# EasyEDA Pro project MalO_SAO_EasyEDA.eprj, board PCB1
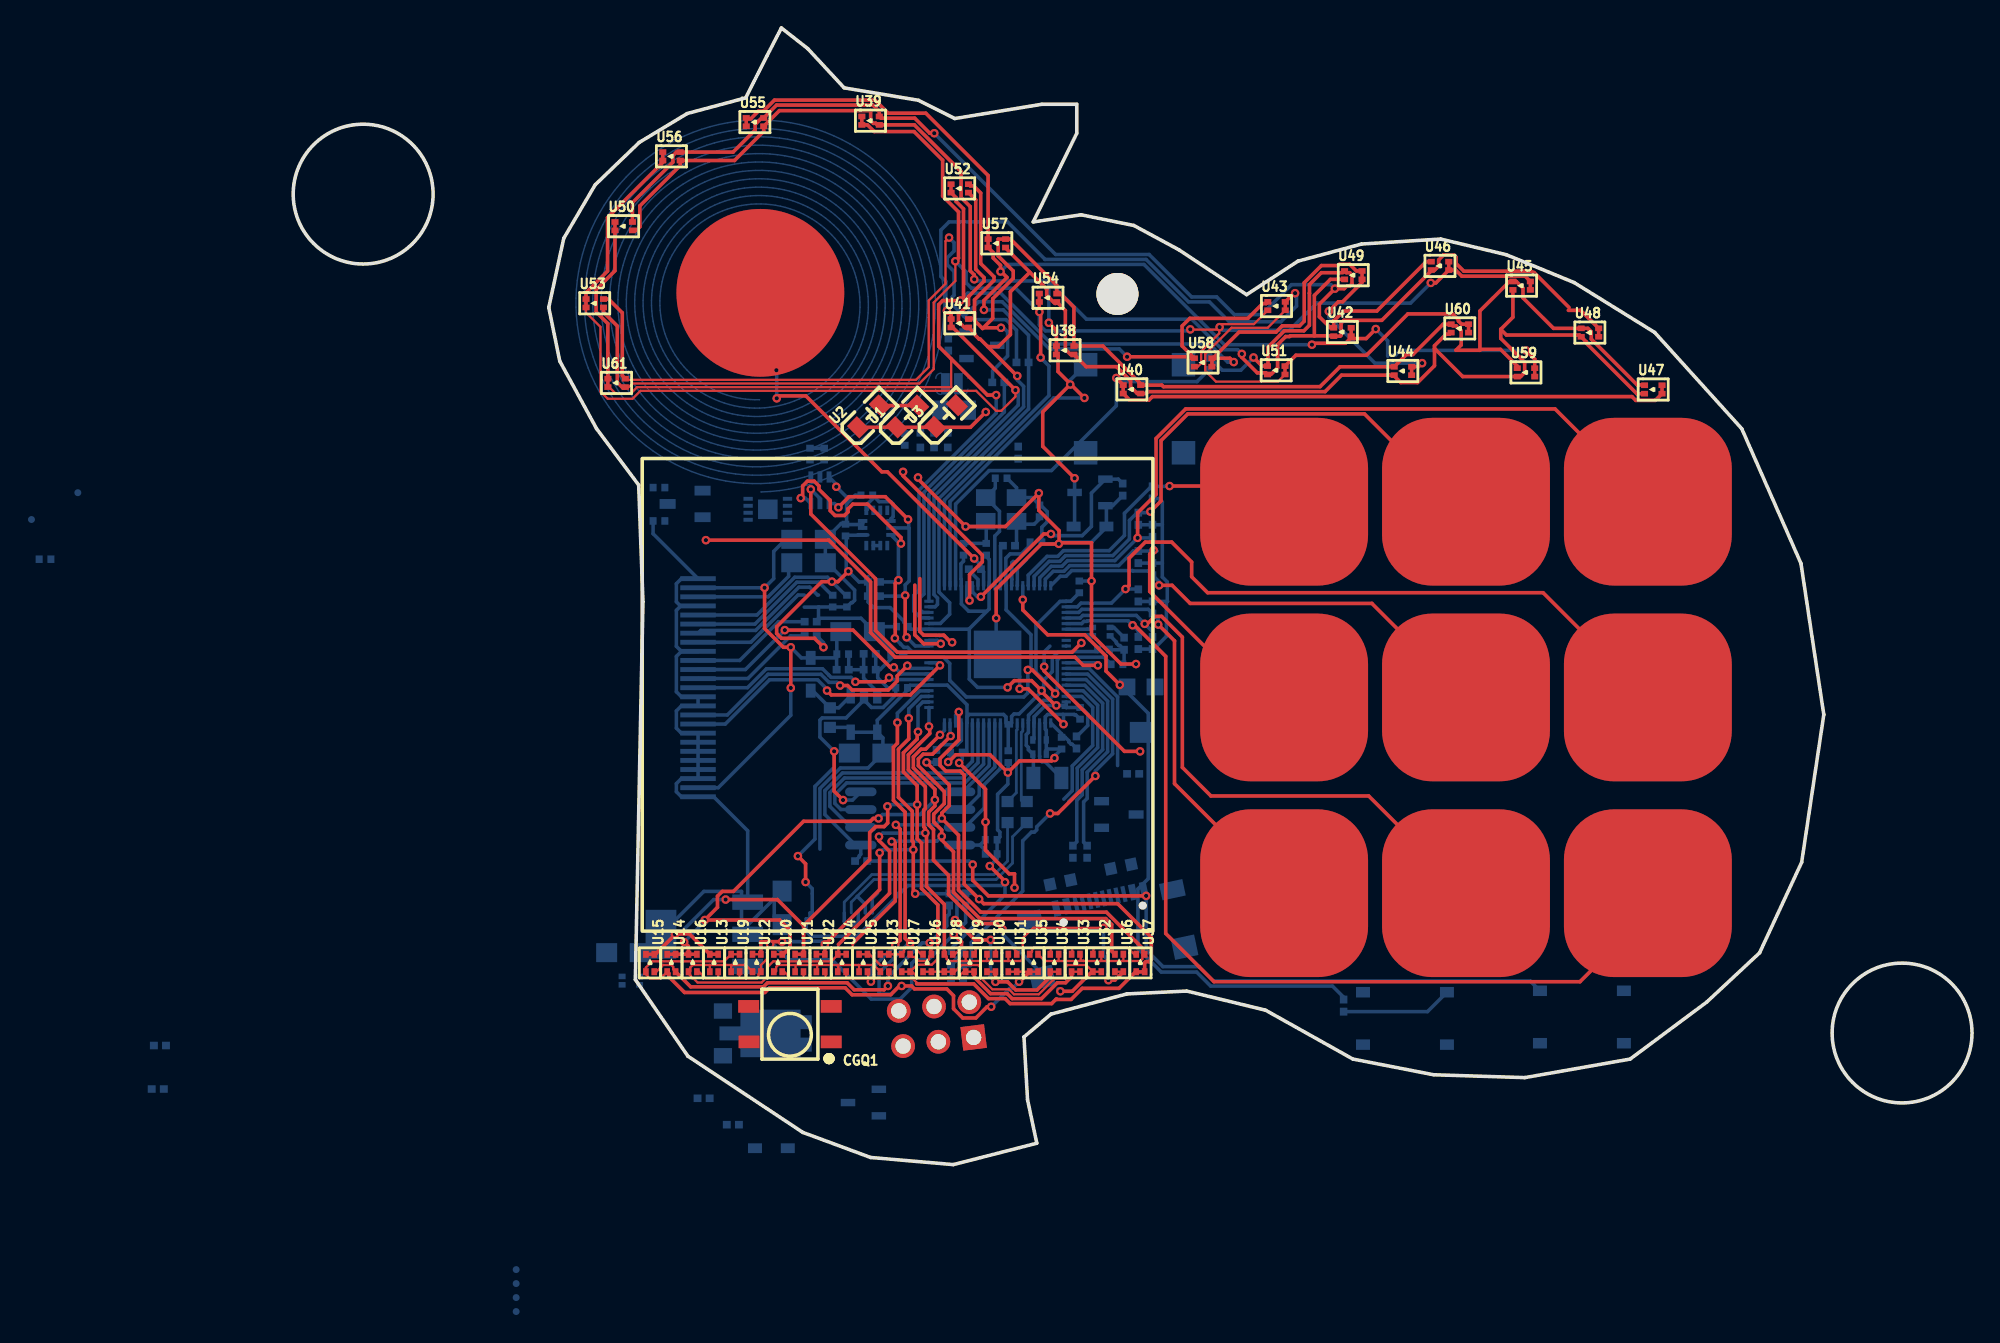
[diagram p4: board, top side]
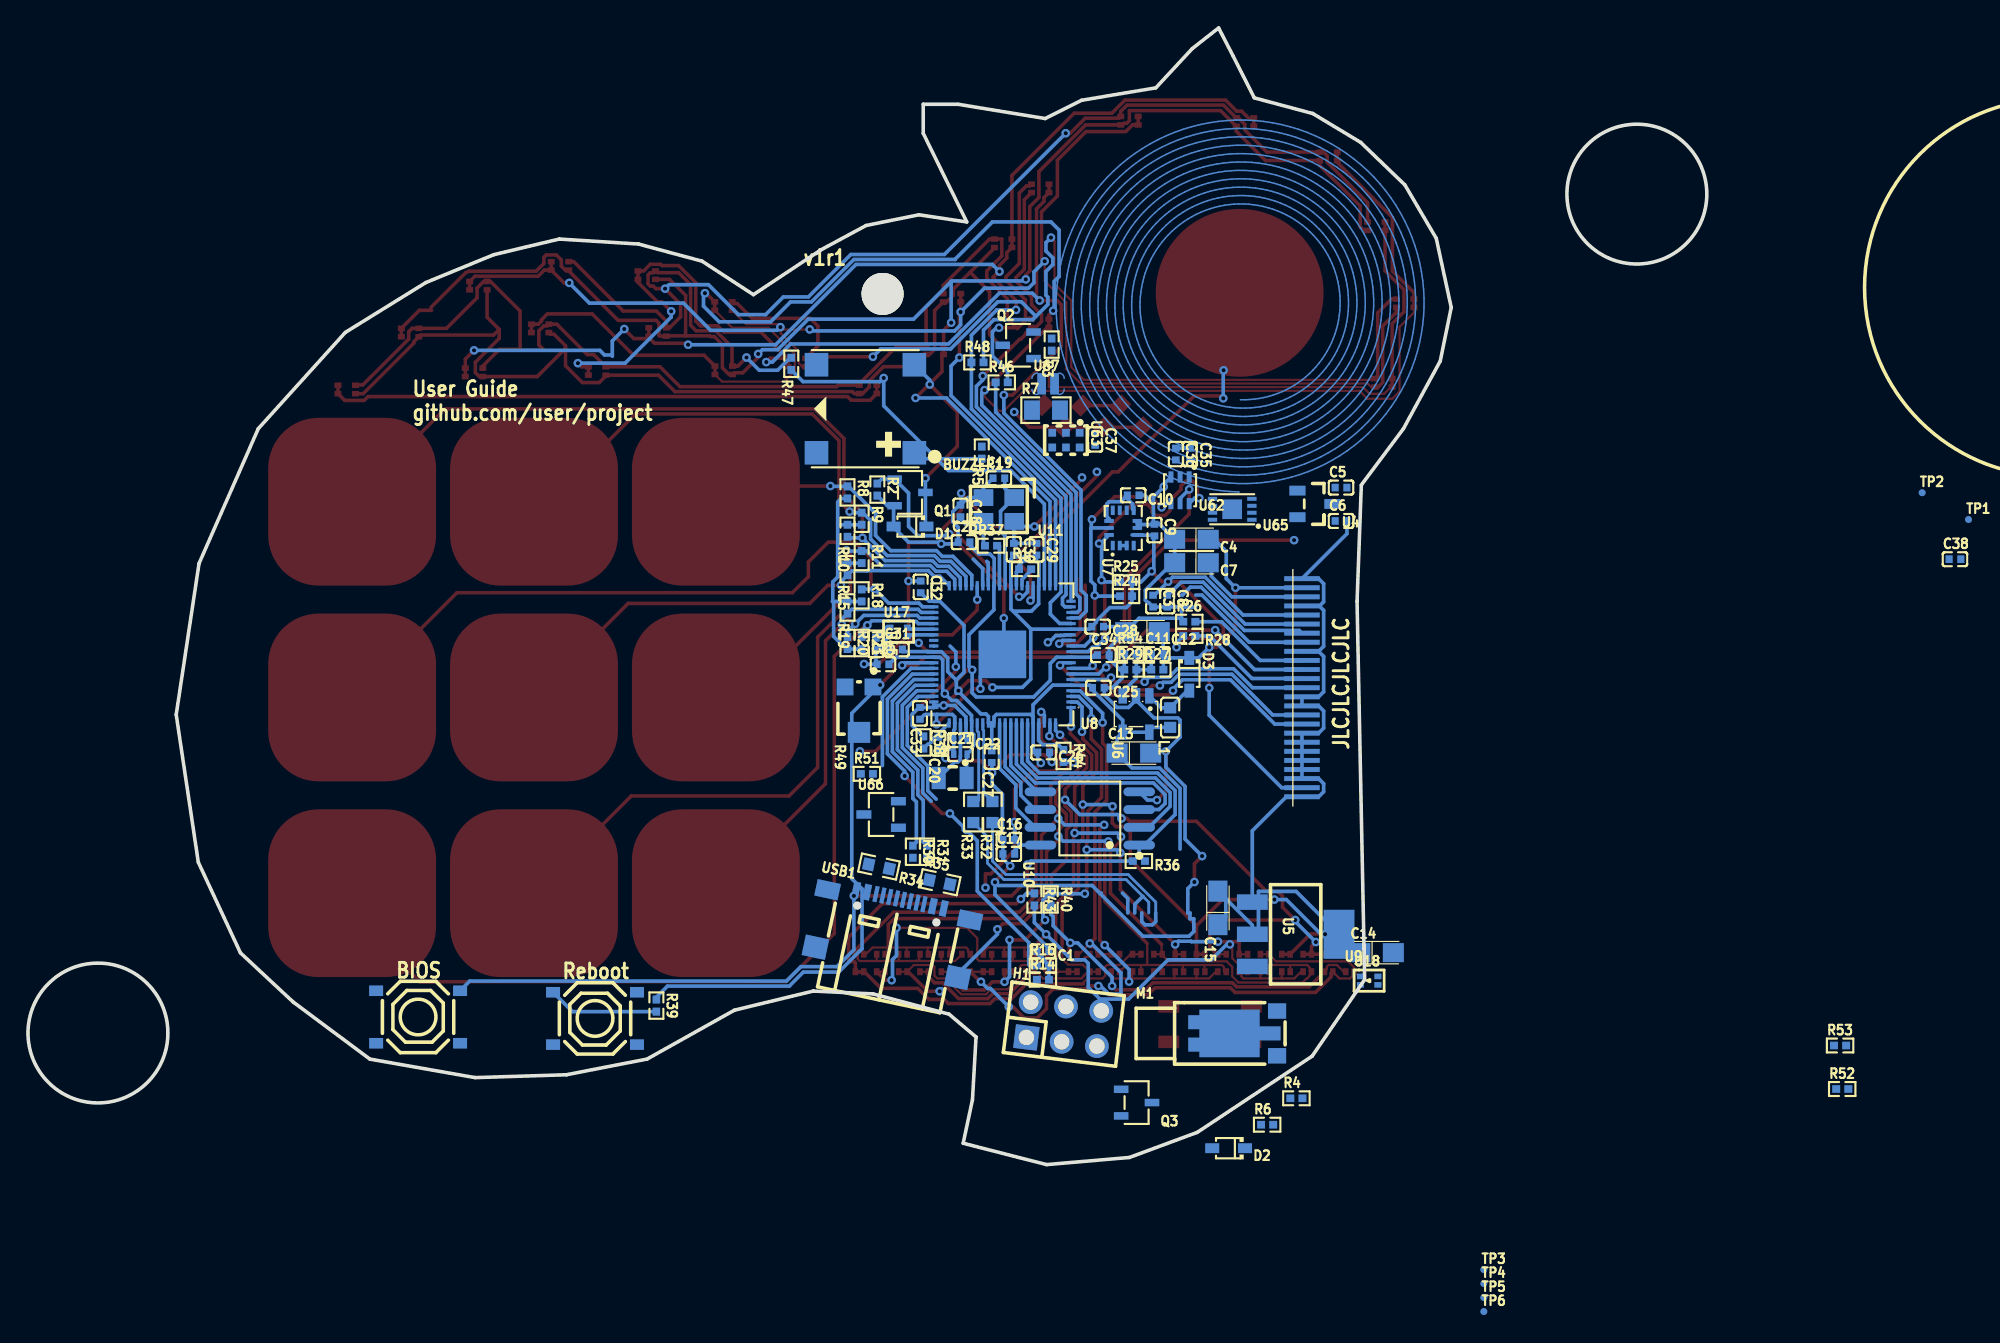
[diagram p5: board, bottom side, seen from below]

Outline 120 x 81.29 mm; copper layers: Top Layer, Bottom Layer. Coordinates in mm from the lower left corner of the outline.
Outline path: circle c5,69.41 r5 ; circle c115,9.41 r5 ; 18.27,61.3 19.34,66.25 21.58,70.07 24.74,73.11 28.16,75.17 32.34,76.3 33.86,79.29 34.89,81.29 36.78,79.81 39.38,77.01 44.69,76.12 47.29,74.82 53.51,75.84 56.01,75.84 56.01,73.76 52.9,67.42 56.31,67.93 60.09,67.17 63.3,65.43 68.15,62.22 71.82,64.62 76.36,65.84 82.02,66.2 86.71,65.08 91.56,63.09 97.32,59.52 103.54,52.63 107.77,42.99 109.41,32.18 107.82,21.62 104.81,15.15 101.04,11.63 95.56,7.55 88.04,6.22 81.51,6.43 75.75,7.55 69.5,11.04 63.86,12.41 59.59,12.21 54.17,10.76 52.23,9.13 52.49,4.64 53.15,1.53 47.19,0 41.27,0.51 36.43,2.3 28.21,7.75 24.46,13.23 25,40.26 24.69,48.6 21.69,52.63 19.05,57.47 18.27,61.3
Stack: Top Layer 0.035mm / Dielectric1 1.51mm FR4 er 4.5 / Bottom Layer 0.035mm

## Design rules (mm)
template: JLCPCB Capability(Two Layers Board)
spacing copperThickness1oz (default): track to track 0.102, other pairs 0.152 to 0.3
spacing copperThickness2oz: track to track 0.203, other pairs 0.152 to 0.3
track width copperThickness1oz (default): min 0.127, default 0.254, max 2.54
track width copperThickness2oz: min 0.203, default 0.254, max 2.54
differential pair differentialPair (default): width min 0.127, default 0.254, max 2.54; gap min 0.152, default 0.152
via viaSize (default): diameter min 0.5, default 0.61, max 10; hole min 0.3, default 0.305, max 6.3

## Placement (name value [footprint] x y rotation side)
BUZZER1  2.7kHz  [BUZ-SMD_4P-L7.5-W7.5-P7.59-TL]  60.14 54.06 0 bottom
C1  2.2uF  [C0402#2]  47.45 15.26 0 bottom
C3  100nF  [C0402#2]  39.58 40.3 270 bottom
C4  10uF  [CASE-A_3216]  36.84 44.72 0 bottom
C5  100nF  [C0402#2]  26.14 48.42 180 bottom
C6  100nF  [C0402#2]  26.14 46.03 180 bottom
C7  10uF  [CASE-A_3216]  36.84 43.05 0 bottom
C8  100nF  [C0402#2]  38.56 40.3 270 bottom
C9  100nF  [C0402#2]  39.48 45.38 270 bottom
C10  100nF  [C0402#2]  41 47.87 0 bottom
C11  100nF  [C0402#2]  39.28 36.51 180 bottom
C12  10uF  [CASE-A_3216]  40.34 38.12 0 bottom
C13  10uF  [CASE-A_3216]  40.95 29.43 180 bottom
C14  10uF  [CASE-A_3216]  23.61 15.16 180 bottom
C15  22uF  [CASE-A_3216]  34.94 18.36 90 bottom
C16  100nF  [C0402#2]  49.89 23.23 180 bottom
C17  4.7uF  [C0402#2]  49.89 22.22 180 bottom
C18  15pF  [C0402#2]  53.35 46.75 270 bottom
C19  15pF  [C0402#2]  50.6 49.09 180 bottom
C20  4.7uF  [C0402#2]  54.92 30.14 90 bottom
C21  4.7uF  [C0402]  53.35 29.36 180 bottom
C22  4.7uF  [C0402]  53.35 30.37 0 bottom
C23  100nF  [C0402#2]  53.09 44.52 180 bottom
C24  100nF  [C0402#2]  58.88 35.78 180 bottom
C25  100nF  [C0402#2]  43.49 34.11 0 bottom
C26  100nF  [C0402#2]  47.4 29.48 0 bottom
C27  100nF  [C0402#2]  51.11 29.18 90 bottom
C28  100nF  [C0402#2]  43.54 38.47 0 bottom
C29  100nF  [C0402#2]  47.91 44.01 270 bottom
C30  100nF  [C0402#2]  49.54 44.01 270 bottom
C31  100nF  [C0402#2]  57.92 36.85 180 bottom
C32  100nF  [C0402#2]  56.19 41.32 270 bottom
C33  100nF  [C0402#2]  56.24 32.28 90 bottom
C34  4.7uF  [C0402#2]  43.14 36.44 180 bottom
C35  100nF  [C0402#2]  36.94 50.82 270 bottom
C36  4.7uF  [C0402#2]  37.95 50.82 270 bottom
C37  100nF  [C0402#2]  43.72 51.87 270 bottom
C38  100nF  [C0402#2]  -17.74 43.3 180 bottom
CGQ1  IRM-H638T/TR2  [SENSOR-SMD_IRM-H638T-TR2-TL]  35.51 10.05 180 top
D1  1N5819WS  [SOD-323_L1.8-W1.3-LS2.5-RD]  56.95 45.64 0 bottom
D2  1N5819WS  [SOD-323_L1.8-W1.3-LS2.5-RD]  34.18 1.17 0 bottom
D3  1N5819WS  [SOD-323_L1.8-W1.3-LS2.5-RD]  36.99 35.07 270 bottom
H1  PZ254V-12-6P  [HDR-TH_6P-P2.54-V-M-R2-C3-S2.54]  45.96 10.05 187 bottom
L1  10uH  [L0603]  38.36 31.97 90 bottom
L2  3.3uH  [IND-SMD_L2.0-W1.6_AOTA-B201610S3R3-101-T]  53.91 27.65 180 bottom
M1  Z3OC1T8219731  [VIBRATING-MOTOR-SMD_3P-C9900001680]  32.24 9.38 180 bottom
NOREF  -  [Pad_e149]  58.91 62.27 0 top
Q1  L2N7002SLLT1G  [SOT-23-3_L3.0-W1.7-P0.95-LS2.9-BR]  56.95 48.08 0 bottom
Q2  L2N7002SLLT1G  [SOT-23-3_L3.0-W1.7-P0.95-LS2.9-BR]  49.22 58.6 180 bottom
Q3  L2N7002SLLT1G  [SOT-23-3_L3.0-W1.7-P0.95-LS2.9-BR]  40.76 4.44 0 bottom
R1  1MΩ  [R0402]  48.72 42.59 180 bottom
R2  10kΩ  [R0402]  59.29 48.28 270 bottom
R3  10kΩ  [R0402]  46.83 58.65 90 bottom
R4  10kΩ  [R0402]  29.33 4.74 180 bottom
R5  0Ω  [R0402]  51.82 50.92 90 bottom
R6  5.1Ω  [R0402]  31.43 2.86 180 bottom
R7  22Ω  [R0805]  47.24 53.96 180 bottom
R8  1MΩ  [R0402]  61.42 48.08 270 bottom
R9  1MΩ  [R0402]  60.41 46.2 270 bottom
R10  1MΩ  [R0402]  61.42 45.33 90 bottom
R11  1MΩ  [R0402]  60.41 43.45 270 bottom
R14  200Ω  [R0402]  47.45 13.23 180 bottom
R15  1MΩ  [R0402]  61.42 42.59 90 bottom
R16  20kΩ  [R0402]  47.45 14.24 180 bottom
R18  1MΩ  [R0402]  60.41 40.71 270 bottom
R19  1MΩ  [R0402]  61.42 39.85 90 bottom
R20  1MΩ  [R0402]  61.42 37.31 270 bottom
R21  1MΩ  [R0402]  60.41 37.31 270 bottom
R24  2.2kΩ  [R0402]  41.51 40.66 180 bottom
R25  2.2kΩ  [R0402]  41.51 41.67 180 bottom
R26  1MΩ  [R0402]  36.99 38.83 180 bottom
R27  100kΩ  [R0402]  39.28 35.4 180 bottom
R28  10kΩ  [R0402]  36.99 37.81 0 bottom
R29  10kΩ  [R0402]  41.21 35.4 180 bottom
R30  1kΩ  [R0402]  56.75 22.38 270 bottom
R31  1kΩ  [R0402]  55.73 22.38 270 bottom
R32  27Ω  [R0603]  51.06 25.22 90 bottom
R33  27Ω  [R0603]  52.43 25.22 90 bottom
R34  5.1kΩ  [R0603]  59.17 21.32 12 bottom
R35  5.1kΩ  [R0603]  54.84 20.2 192 bottom
R36  1kΩ  [R0402]  40.6 21.71 0 bottom
R37  1kΩ  [R0402]  51.16 44.27 180 bottom
R38  33Ω  [R0402]  55.99 30.19 270 bottom
R39  1kΩ  [R0402]  75.08 11.37 270 bottom
R40  36Ω  [R0402]  46.9 18.97 270 bottom
R43  36Ω  [R0402]  48.06 18.97 270 bottom
R44  36Ω  [R0402]  45.98 29.23 270 bottom
R45  36Ω  [R0402]  59.39 37.25 270 bottom
R46  36Ω  [R0402]  50.4 55.95 180 bottom
R47  36Ω  [R0402]  65.44 57.27 90 bottom
R48  36Ω  [R0402]  52.13 57.38 180 bottom
R49  10kΩ  [RES-ADJ-SMD_3P-L3.0-W3.8-P1.75-BR]  60.6 32.54 90 bottom
R51  2kΩ  [R0402]  60.04 27.95 180 bottom
R52  10kΩ  [R0402]  -9.68 5.41 180 bottom
R53  10kΩ  [R0402]  -9.53 8.52 180 bottom
R54  75kΩ  [R0402]  41.21 36.53 180 bottom
SW1  TS-1187A-B-A-B  [SW-SMD_4P-L5.1-W5.1-P3.70-LS6.5-TL_H1.5]  92.12 10.56 0 bottom
SW2  TS-1187A-B-A-B  [SW-SMD_4P-L5.1-W5.1-P3.70-LS6.5-TL_H1.5]  79.47 10.46 180 bottom
TOUCH_CCW1  -  [touch_12mm]  70.83 33.41 0 top
TOUCH_CW1  -  [touch_12mm]  96.83 33.41 0 top
TOUCH_DOWN1  -  [touch_12mm]  83.83 19.41 0 top
TOUCH_FACE1  -  [touch_12mm#2]  33.39 62.35 0 top
TOUCH_LEFT1  -  [touch_12mm]  70.83 19.41 0 top
TOUCH_MENU1  -  [touch_12mm]  70.83 47.41 0 top
TOUCH_NO1  -  [touch_12mm]  96.83 47.41 0 top
TOUCH_RIGHT1  -  [touch_12mm]  96.83 19.41 0 top
TOUCH_UP1  -  [touch_12mm]  83.83 33.41 0 top
TOUCH_YES1  -  [touch_12mm]  83.83 47.41 0 top
TP1  -  [Test-Point-0.5mm]  -18.71 46.14 180 bottom
TP2  -  [Test-Point-0.5mm]  -15.39 48.06 180 bottom
TP3  -  [Test-Point-0.5mm]  15.94 -7.51 180 bottom
TP4  -  [Test-Point-0.5mm]  15.94 -8.51 180 bottom
TP5  -  [Test-Point-0.5mm]  15.94 -9.51 180 bottom
TP6  -  [Test-Point-0.5mm]  15.94 -10.51 180 bottom
U1  XL-2012IRC-940  [LED0805-RD]  43.9 53.51 45 top
U2  XL-2012IRC-940  [LED0805-RD]  41.15 53.51 45 top
U3  XL-2012IRC-940  [LED0805-RD]  46.67 53.54 45 top
U4  HAL403SO  [SOT-23-3_L2.9-W1.3-P1.90-LS2.4-BR-CW]  28.01 47.25 0 bottom
U5  -  [ssd1327_128x128]  28.94 34.11 90 bottom
U6  MT3540-F23  [SOT-23-5_L3.0-W1.7-P0.95-LS2.8-BR]  40.8 32.23 90 bottom
U7  LSM6DS3TR  [LGA-14_L3.0-W2.5-P0.50-TL]  41.71 45.53 90 bottom
U8  RP2350B  [QFN-80_L10.0-W10.0-P0.40-TL-EP3.4]  50.35 36.49 0 bottom
U9  LD1117-3.3  [SOT-223_L6.7-W3.5-P2.30-BR]  29.39 16.47 0 bottom
U10  W25Q128JVSIQ  [SOIC-8_L5.3-W5.3-P1.27-LS8.0-BL]  44.1 24.76 90 bottom
U11  ABM8-272-T3  [SMD3225-4P_SMD3225-4P]  50.6 46.86 0 bottom
U12  XL-1608SURUGC  [LED-SMD_4P-L1.6-W0.8-RD_1]  33.13 14.42 270 top
U13  XL-1608SURUGC  [LED-SMD_4P-L1.6-W0.8-RD_1]  30.08 14.42 270 top
U14  XL-1608SURUGC  [LED-SMD_4P-L1.6-W0.8-RD_1]  27.03 14.42 270 top
U15  XL-1608SURUGC  [LED-SMD_4P-L1.6-W0.8-RD_1]  25.51 14.42 270 top
U16  XL-1608SURUGC  [LED-SMD_4P-L1.6-W0.8-RD_1]  28.56 14.42 270 top
U17  XL-1608SURUGC  [LED-SMD_4P-L1.6-W0.8-RD_1]  57.77 38.12 180 bottom
U18  XL-1608SURUGC  [LED-SMD_4P-L1.6-W0.8-RD_1]  24.13 13.16 180 bottom
U19  XL-1608SURUGC  [LED-SMD_4P-L1.6-W0.8-RD_1]  31.6 14.42 270 top
U20  XL-1608SURUGC  [LED-SMD_4P-L1.6-W0.8-RD_1]  34.65 14.42 270 top
U21  XL-1608SURUGC  [LED-SMD_4P-L1.6-W0.8-RD_1]  36.18 14.42 270 top
U22  XL-1608SURUGC  [LED-SMD_4P-L1.6-W0.8-RD_1]  37.7 14.42 270 top
U23  XL-1608SURUGC  [LED-SMD_4P-L1.6-W0.8-RD_1]  42.27 14.42 270 top
U24  XL-1608SURUGC  [LED-SMD_4P-L1.6-W0.8-RD_1]  39.22 14.42 270 top
U25  XL-1608SURUGC  [LED-SMD_4P-L1.6-W0.8-RD_1]  40.75 14.42 270 top
U26  XL-1608SURUGC  [LED-SMD_4P-L1.6-W0.8-RD_1]  45.32 14.42 270 top
U27  XL-1608SURUGC  [LED-SMD_4P-L1.6-W0.8-RD_1]  43.8 14.42 270 top
U28  XL-1608SURUGC  [LED-SMD_4P-L1.6-W0.8-RD_1]  46.84 14.42 270 top
U29  XL-1608SURUGC  [LED-SMD_4P-L1.6-W0.8-RD_1]  48.37 14.42 270 top
U30  XL-1608SURUGC  [LED-SMD_4P-L1.6-W0.8-RD_1]  49.89 14.42 270 top
U31  XL-1608SURUGC  [LED-SMD_4P-L1.6-W0.8-RD_1]  51.42 14.42 270 top
U32  XL-1608SURUGC  [LED-SMD_4P-L1.6-W0.8-RD_1]  57.46 14.42 270 top
U33  XL-1608SURUGC  [LED-SMD_4P-L1.6-W0.8-RD_1]  55.94 14.42 270 top
U34  XL-1608SURUGC  [LED-SMD_4P-L1.6-W0.8-RD_1]  54.41 14.42 270 top
U35  XL-1608SURUGC  [LED-SMD_4P-L1.6-W0.8-RD_1]  52.94 14.42 270 top
U36  XL-1608SURUGC  [LED-SMD_4P-L1.6-W0.8-RD_1]  59.04 14.42 270 top
U37  XL-1608SURUGC  [LED-SMD_4P-L1.6-W0.8-RD_1]  60.56 14.42 270 top
U38  XL-1608SURUGC  [LED-SMD_4P-L1.6-W0.8-RD_1]  55.18 58.24 0 top
U39  XL-1608SURUGC  [LED-SMD_4P-L1.6-W0.8-RD_1]  41.27 74.66 0 top
U40  XL-1608SURUGC  [LED-SMD_4P-L1.6-W0.8-RD_1]  59.95 55.45 0 top
U41  XL-1608SURUGC  [LED-SMD_4P-L1.6-W0.8-RD_1]  47.65 60.17 0 top
U42  XL-1608SURUGC  [LED-SMD_4P-L1.6-W0.8-RD_1]  75 59.55 0 top
U43  XL-1608SURUGC  [LED-SMD_4P-L1.6-W0.8-RD_1]  70.29 61.4 0 top
U44  XL-1608SURUGC  [LED-SMD_4P-L1.6-W0.8-RD_1]  79.32 56.76 0 top
U45  XL-1608SURUGC  [LED-SMD_4P-L1.6-W0.8-RD_1]  87.81 62.86 0 top
U46  XL-1608SURUGC  [LED-SMD_4P-L1.6-W0.8-RD_1]  81.97 64.28 0 top
U47  XL-1608SURUGC  [LED-SMD_4P-L1.6-W0.8-RD_1]  97.22 55.44 0 top
U48  XL-1608SURUGC  [LED-SMD_4P-L1.6-W0.8-RD_1]  92.69 59.51 0 top
U49  XL-1608SURUGC  [LED-SMD_4P-L1.6-W0.8-RD_1]  75.78 63.61 0 top
U50  XL-1608SURUGC  [LED-SMD_4P-L1.6-W0.8-RD_1]  23.62 67.12 0 top
U51  XL-1608SURUGC  [LED-SMD_4P-L1.6-W0.8-RD_1]  70.27 56.81 0 top
U52  XL-1608SURUGC  [LED-SMD_4P-L1.6-W0.8-RD_1]  47.64 69.82 0 top
U53  XL-1608SURUGC  [LED-SMD_4P-L1.6-W0.8-RD_1]  21.56 61.6 0 top
U54  XL-1608SURUGC  [LED-SMD_4P-L1.6-W0.8-RD_1]  53.96 62 0 top
U55  XL-1608SURUGC  [LED-SMD_4P-L1.6-W0.8-RD_1]  33.01 74.56 0 top
U56  XL-1608SURUGC  [LED-SMD_4P-L1.6-W0.8-RD_1]  27.04 72.11 0 top
U57  XL-1608SURUGC  [LED-SMD_4P-L1.6-W0.8-RD_1]  50.3 65.89 0 top
U58  XL-1608SURUGC  [LED-SMD_4P-L1.6-W0.8-RD_1]  65.04 57.37 0 top
U59  XL-1608SURUGC  [LED-SMD_4P-L1.6-W0.8-RD_1]  88.12 56.66 0 top
U60  XL-1608SURUGC  [LED-SMD_4P-L1.6-W0.8-RD_1]  83.39 59.81 0 top
U61  XL-1608SURUGC  [LED-SMD_4P-L1.6-W0.8-RD_1]  23.12 55.91 0 top
U62  LTR-308ALS-01  [SENSOR-SMD_6P-L2.0-W2.0-P0.65-BL]  37.65 48.23 0 bottom
U63  LMD2718T261-OA1  [MIC-SMD_6P-L2.8-W1.9-P0.98-TL]  45.81 51.82 270 bottom
U65  13.56MHz  [UFDFN-8_L3.0-W2.0-P0.50-TL-EP1.4]  33.92 46.87 0 bottom
U66  LM385DBZ-1.2RG  [SOT-23-3_L2.9-W1.6-P1.90-LS2.8-BR]  59.02 25.04 180 bottom
U67  -  [open_solder_jumper]  47.08 55.84 180 bottom
U68  -  [rfid_antenna]  33.21 61.56 0 bottom
USB1  TYPE-C 16P QTWT  [USB-TYPE-C-SMD_TYPE-C-16P-QTWT]  58.15 16.73 192 bottom

## Footprints (pads in the part's own frame, mm; a bottom-side part is the same pattern mirrored in y, then rotated)
BUZ-SMD_4P-L7.5-W7.5-P7.59-TL
  rect 1.681x1.68 smd: 1(-3.498,3.15) 2(-3.498,-3.15) 3(3.498,-3.15) 4(3.498,3.15)
C0402
  rect 0.38x0.54 smd: 1(-0.48,0) 2(0.48,0)
C0402#2
  rect 0.5x0.54 smd: 1(-0.42,0) 2(0.42,0)
CASE-A_3216
  rect 1.5x1.359 smd: 1(-1.2,0) 2(1.2,0)
HDR-TH_6P-P2.54-V-M-R2-C3-S2.54
  rect 1.7x1.7 hole 1.1: 1(-2.54,-1.27)
  round 1.7 hole 1.1: 2(-2.54,1.27) 3(0,-1.27) 4(0,1.27) 5(2.54,-1.27) 6(2.54,1.27)
IND-SMD_L2.0-W1.6_AOTA-B201610S3R3-101-T
  rect 1x1.6 smd: 1(-1,0) 2(1,0)
L0603
  rect 0.8x0.864 smd: 1(-0.7,0) 2(0.7,0)
LED0805-RD
  rect 1x1.25 smd: 1(-1.1,0) 2(1.1,0)
LED-SMD_4P-L1.6-W0.8-RD_1
  rect 0.5x0.4 smd: 1(-0.625,0.3) 2(0.625,0.3) 3(-0.625,-0.3) 4(0.625,-0.3)
LGA-14_L3.0-W2.5-P0.50-TL
  rect 0.675x0.28 smd: 1(-1.262,0.75) 2(-1.262,0.25) 3(-1.262,-0.25) 4(-1.262,-0.75) 8(1.262,-0.75) 9(1.262,-0.25) 10(1.262,0.25) 11(1.262,0.75)
  rect 0.28x0.675 smd: 5(-0.5,-1.012) 6(0,-1.012) 7(0.5,-1.012) 12(0.5,1.012) 13(0,1.012) 14(-0.5,1.012)
MIC-SMD_6P-L2.8-W1.9-P0.98-TL
  rect 0.55x0.55 smd: 1(-0.525,0.98) 2(-0.525,0) 3(-0.525,-0.98) 4(0.525,0.98) 5(0.525,0) 6(0.525,-0.98)
open_solder_jumper
  custom 1x1.524 smd: 1(-0.65,0) 2(0.65,0)
Pad_e149
  round 3 hole 3: 1(0,0)
QFN-80_L10.0-W10.0-P0.40-TL-EP3.4
  rect 0.665x0.22 smd: 1(-4.907,3.8) 2(-4.907,3.4) 3(-4.907,3) 4(-4.907,2.6) 5(-4.907,2.2) 6(-4.907,1.8) 7(-4.907,1.4) 8(-4.907,1) 9(-4.907,0.6) 10(-4.907,0.2) 11(-4.907,-0.2) 12(-4.907,-0.6) 13(-4.907,-1) 14(-4.907,-1.4) 15(-4.907,-1.8) 16(-4.907,-2.2) 17(-4.907,-2.6) 18(-4.907,-3) 19(-4.907,-3.4) 20(-4.907,-3.8) 41(4.907,-3.8) 42(4.907,-3.4) 43(4.907,-3) 44(4.907,-2.6) 45(4.907,-2.2) 46(4.907,-1.8) 47(4.907,-1.4) 48(4.907,-1) 49(4.907,-0.6) 50(4.907,-0.2) 51(4.907,0.2) 52(4.907,0.6) 53(4.907,1) 54(4.907,1.4) 55(4.907,1.8) 56(4.907,2.2) 57(4.907,2.6) 58(4.907,3) 59(4.907,3.4) 60(4.907,3.8)
  rect 0.22x0.665 smd: 21(-3.8,-4.907) 22(-3.4,-4.907) 23(-3,-4.907) 24(-2.6,-4.907) 25(-2.2,-4.907) 26(-1.8,-4.907) 27(-1.4,-4.907) 28(-1,-4.907) 29(-0.6,-4.907) 30(-0.2,-4.907) 31(0.2,-4.907) 32(0.6,-4.907) 33(1,-4.907) 34(1.4,-4.907) 35(1.8,-4.907) 36(2.2,-4.907) 37(2.6,-4.907) 38(3,-4.907) 39(3.4,-4.907) 40(3.8,-4.907) 61(3.8,4.907) 62(3.4,4.907) 63(3,4.907) 64(2.6,4.907) 65(2.2,4.907) 66(1.8,4.907) 67(1.4,4.907) 68(1,4.907) 69(0.6,4.907) 70(0.2,4.907) 71(-0.2,4.907) 72(-0.6,4.907) 73(-1,4.907) 74(-1.4,4.907) 75(-1.8,4.907) 76(-2.2,4.907) 77(-2.6,4.907) 78(-3,4.907) 79(-3.4,4.907) 80(-3.8,4.907)
  rect 3.4x3.4 smd: 81(0,0)
R0402
  rect 0.566x0.54 smd: 1(-0.433,0) 2(0.433,0)
R0603
  rect 0.806x0.864 smd: 1(-0.753,0) 2(0.753,0)
R0805
  rect 1.133x1.377 smd: 1(-1,0) 2(1,0)
RES-ADJ-SMD_3P-L3.0-W3.8-P1.75-BR
  rect 1.2x1.2 smd: 1(1.625,-1) 3(1.625,1)
  rect 1.5x1.6 smd: 2(-1.625,0)
rfid_antenna
  round 0.1 smd: 1(0.119,6.849) 2(0.234,13.448)
SENSOR-SMD_6P-L2.0-W2.0-P0.65-BL
  rect 0.35x0.8 smd: 1(-0.65,-0.95) 2(0,-0.95) 3(0.65,-0.95) 4(0.65,0.95) 5(0,0.95) 6(-0.65,0.95)
SENSOR-SMD_IRM-H638T-TR2-TL
  rect 1.5x0.9 smd: 1(-2.95,1.27) 2(-2.95,-1.27) 3(2.95,-1.27) 4(2.921,1.27)
SMD3225-4P_SMD3225-4P
  rect 1.4x1.2 smd: 1(-1.1,-0.85) 2(1.1,-0.85) 3(1.1,0.85) 4(-1.1,0.85)
SOD-323_L1.8-W1.3-LS2.5-RD
  rect 1x0.7 smd: 1(-1.173,0) 2(1.173,0)
SOIC-8_L5.3-W5.3-P1.27-LS8.0-BL
  oval 0.63x2.25 smd: 1(-1.905,-3.53) 2(-0.635,-3.53) 3(0.635,-3.53) 4(1.905,-3.53) 5(1.905,3.53) 6(0.635,3.53) 7(-0.635,3.53) 8(-1.905,3.53)
SOT-23-3_L2.9-W1.3-P1.90-LS2.4-BR-CW
  rect 1.15x0.7 smd: 1(1.25,-0.95) 2(-1.25,0) 3(1.25,0.95)
SOT-23-3_L2.9-W1.6-P1.90-LS2.8-BR
  rect 1.07x0.6 smd: 1(1.235,-0.95) 2(1.235,0.95) 3(-1.235,0)
SOT-23-3_L3.0-W1.7-P0.95-LS2.9-BR
  rect 1.038x0.532 smd: 1(1.101,-0.95) 2(1.101,0.95) 3(-1.101,0)
SOT-23-5_L3.0-W1.7-P0.95-LS2.8-BR
  rect 1.1x0.6 smd: 1(1.3,-0.95) 2(1.3,0) 3(1.3,0.95) 4(-1.3,0.95) 5(-1.3,-0.95)
SOT-223_L6.7-W3.5-P2.30-BR
  rect 2.2x1.1 smd: 1(3.099,-2.3) 2(3.099,0) 3(3.099,2.3)
  rect 2.2x3.5 smd: 4(-3.099,0)
ssd1327_128x128
  rect 0.35x2.54 smd: 1(7.803,0) 2(7.152,0) 3(6.503,0) 4(5.853,0) 5(5.203,0) 6(4.553,0) 7(3.903,0) 8(3.253,0) 9(2.603,0) 10(1.953,0) 11(1.303,0) 12(0.653,0) 13(0.003,0) 14(-0.647,0) 15(-1.297,0) 16(-1.947,0) 17(-2.597,0) 18(-3.247,0) 19(-3.897,0) 20(-4.547,0) 21(-5.197,0) 22(-5.847,0) 23(-6.497,0) 24(-7.147,0) 25(-7.797,0)
SW-SMD_4P-L5.1-W5.1-P3.70-LS6.5-TL_H1.5
  rect 1x0.75 smd: 1(-3,1.875) 2(3,1.875) 3(-3,-1.875) 4(3,-1.875)
Test-Point-0.5mm
  round 0.5 smd: 1(0,0)
touch_12mm
  rrect 12x12 smd: 1(0,0)
touch_12mm#2
  round 12 smd: 1(0,0)
UFDFN-8_L3.0-W2.0-P0.50-TL-EP1.4
  rect 0.665x0.28 smd: 1(-1.407,0.75) 2(-1.407,0.25) 3(-1.407,-0.25) 4(-1.407,-0.75) 5(1.407,-0.75) 6(1.407,-0.25) 7(1.407,0.25) 8(1.407,0.75)
  rect 1.4x1.4 smd: 9(0,0)
USB-TYPE-C-SMD_TYPE-C-16P-QTWT
  rect 1.7x1.5 smd: 0(-5.2,-2.309) 0(5.2,-2.309)
  rect 1.7x1.2 smd: 0(-5.2,1.891) 0(5.2,1.891)
  rect 0.5x1.14 smd: A1(-3.2,2.308) A4(-2.4,2.308) A9(2.4,2.308) A12(3.2,2.308)
  rect 0.3x1.14 smd: A5(-1.25,2.308) A6(-0.25,2.308) A7(0.25,2.308) A8(1.25,2.309) B5(1.75,2.308) B6(0.75,2.308) B7(-0.75,2.308) B8(-1.75,2.309)
VIBRATING-MOTOR-SMD_3P-C9900001680
  rect 1.3x1.1 smd: 1(1.525,1.6) 2(1.525,-1.6)
  custom 6.6x3.4 smd: 3(-1.525,0)

## Nets
As in the schematic, except:
$2N8851: TP2.1 U65.1

Pads without a net: BUZZER1 3 4; NOREF 1; SW1 2 4; SW2 2 4; U7 10 11; U62 2 5; U65 2 3 9; U68 1 2; USB1 A8 B8

## Via types
v1: diameter 0.61, hole 0.305, Top Layer to Bottom Layer, 158 vias

## Routing (per net, layer and track width the routed paths; a pad name or vN(x,y) marks a point on that pad's centre or on a via; arc(x,y) is an arc through that point)
+1V1: length 40.2
  Top Layer w0.254: v1(52.51,35.38) 52.83,35.38 54.46,33.75 v1(54.46,33.68)
  Bottom Layer w0.254: C34.1 43.77,36.44 43.91,36.29 U8.10 46.47,36.29 46.93,35.84 46.93,34.63 48.11,33.44 52.22,33.44 52.51,33.74 v1(52.51,35.38) 52.74,35.61 52.74,37.9 50.96,39.68 50.96,41.39 U8.32 50.94,41.41 50.94,43.37 51.25,43.68 52.05,43.68 52.63,44.27 52.67,44.27 ; C24.2 57.95,36.29 U8.51 55.25,36.28 54.81,36.28 54.62,36.09 54.62,33.84 v1(54.46,33.68) 53.98,33.2 53.62,33.2 52.56,32.14 52.56,31.78 52.55,31.77 U8.65 52.55,30.91 52.4,30.76 52.4,29.99 52.55,29.84 52.55,29.67 C21.2 52.91,29.32 L2.2
+3V3: length 161.2
  Top Layer w0.254: v1(51.06,34.13) 51.54,34.61 52.77,34.61 v1(53.49,33.89) 53.49,33.83 54.48,32.84 v1(54.55,32.84) ; v1(37.9,37) 37.26,37.64 34.9,37.64 34.56,37.99 34.56,38.47 37.78,41.69 v1(38.51,41.69) 38.94,41.69 v1(39.68,42.44) ; v1(47.6,28.73) 49.49,26.84 v1(49.49,24.5) 49.49,22.48 51.18,20.8 51.56,20.8 v1(51.56,19.8)
  Bottom Layer w0.254: 34.94,17.16 34.38,17.72 34.38,19.02 32.48,17.12 U9.2 32.05,16.91 32.05,19.54 29.36,19.54 26.29,16.47 ; 55.69,36.69 57.5,36.69 57.55,36.75 ; 55.69,36.69 55.68,36.68 55.26,36.68 ; 55.69,36.69 55.26,36.68 ; U5.5 33.15,39.31 35.85,42.01 38.19,42.01 v1(38.51,41.69) 39.48,40.72 C3.1 ; 53.65,34.66 53.09,35.22 53.09,38.57 54.81,40.28 55.25,40.28 U8.41 55.59,40.29 C32.2 ; 53.65,34.66 54.26,35.27 54.26,36.24 54.71,36.68 55.26,36.68 ; 53.65,34.66 53.64,34.65 53.64,33.72 53.37,33.72 51.88,32.23 51.52,32.23 51.35,32.06 U8.68 51.11,31.59 C27.2 ; v1(37.9,37) 37.9,37.33 R28.2 ; 41.75,30.93 U6.5 39.85,31.27 L1.1 ; 41.75,30.93 42.15,30.52 C13.1 41.09,28.37 39.11,28.37 37.65,26.9 37.65,22.57 ; 41.75,30.93 41.75,31.78 43.91,33.94 C25.2 44.09,34.28 45.43,34.28 U8.5 46.76,34.29 48.16,32.89 48.16,32.03 ; v1(49.49,24.5) 49.47,24.49 C16.2 49.09,22.85 ; v1(51.06,34.13) 48.91,34.13 48.32,34.72 48.32,38.29 ; v1(47.6,28.73) 47.82,28.95 47.82,29.48 48.15,29.48 48.15,31.59 48.16,31.6 48.16,32.03 ; 39.53,45.01 39.53,42.59 v1(39.68,42.44) 40.44,41.67 R25.2 ; 39.53,45.01 40.34,45.01 40.36,45.03 41.07,45.03 ; 39.53,45.01 C9.2 ; C22.1 52.95,30.45 U8.64 52.96,31.6 52.96,32.03 53.77,32.84 v1(54.55,32.84) 55.11,32.84 U8.60 ; R38.1 56.01,30.63 56.79,31.4 56.79,32.22 56.32,32.7 56.24,32.7 56.24,32.69 U8.60 ; 49.54,43.49 49.75,43.28 49.75,41.4 49.74,41.39 49.74,39.73 ; U7.8 41.04,46.88 41.04,47.25 41.42,47.63 C10.2 41.88,47.41 42.72,47.41 42.88,47.25 42.88,46.34 42.73,46.19 U7.12 ; C17.2 49.47,22.47 49.09,22.85 ; U8.69 50.95,32.02 50.77,32.2 48.32,32.2 48.16,32.03 ; C29.2 47.91,43.16 47.73,42.97 47.73,41.88 47.75,41.86 47.75,41.4 47.76,41.39 47.76,40.1 48.28,39.58 49.58,39.58 ; C1.2 47.87,15.09 47.57,14.79 47.49,14.79 47.32,14.63 47.32,14.55 R16.2 R14.2 ; 48.32,38.29 48.32,38.32 49.74,39.73 ; 48.32,38.29 U8.15 44.14,38.29 43.65,38.78 43.65,38.86 42.67,39.84 41.5,39.84 41.09,40.24 41.09,40.64 R24.2 R25.2 ; 49.74,39.73 49.74,39.74 ; U8.60 U8.59 ; R25.2 41.08,42.05 ; 49.09,22.85 U10.8
+15V: length 34.4
  Top Layer w0.254: v1(33.69,41.26) 33.69,38.35 35.04,37 v1(35.57,37) v1(35.57,34.09)
  Bottom Layer w0.254: v1(35.57,37) 36.33,36.24 36.99,36.24 D3.1 38.82,36.24 38.84,36.26 R27.2 ; U5.24 30.39,26.96 35.57,32.14 v1(35.57,34.09) ; C11.2 38.86,37.83 C12.1 ; U5.2 v1(33.69,41.26) 34.35,41.91 34.35,43.86 34.96,44.47 35.38,44.47 C4.1
GND: length 248.2
  Top Layer w0.254: v1(50.25,39.08) 50.25,41.16 53.47,44.38 54.74,44.38 ; v1(36.62,20.21) 36.62,21.52 v1(36.07,22.07) ; v1(60.24,35.8) 59.17,35.8 57.06,37.91 v1(57.06,41.74) 57.06,44.47 54.84,44.47 54.74,44.38 ; v1(38.67,29.56) 38.67,26.71 v1(39.3,26.07) ; v1(51.92,34.03) 52.53,34.03 v1(55.06,31.5) ; v1(49.79,21.35) 50.88,20.27 v1(50.88,20.2) ; 54.74,44.38 54.74,45.34 53.3,46.79 v1(53.3,48.02) 50.91,45.64 v1(48.06,45.64) 44.66,49.04 v1(44.66,49.14) ; 54.74,44.38 v1(54.72,44.4) ; v1(54.41,29.08) 54.21,28.87 51.91,28.87 v1(51.08,28.04) 49.81,29.31 47.36,29.31 46.84,28.8 v1(46.82,28.8)
  Bottom Layer w0.254: 36.53,39.87 37.55,39.87 ; 37.55,39.87 37.56,39.88 C8.2 C3.2 39.89,40.19 39.96,40.19 40.13,40.36 40.13,41.09 38.17,43.05 C7.2 C4.2 39.17,45.85 39.48,45.85 ; 37.55,39.87 37.55,39.08 ; C33.1 55.93,32.17 55.86,32.17 55.83,32.2 55.02,32.2 ; U7.7 40.7,45.85 ; 40.7,45.85 U7.6 ; 40.7,45.85 40.62,45.78 39.55,45.78 39.48,45.85 ; 27.75,36.71 27.39,37.07 27.39,39.64 27.7,39.96 U5.4 ; 27.75,36.71 27.39,36.35 27.39,33.82 27.75,33.46 U5.14 U5.15 27.75,32.81 27.39,32.45 27.39,31.22 27.75,30.86 U5.18 U5.19 U5.20 U5.21 U5.22 U5.23 27.75,27.61 27.39,27.25 27.39,26.67 27.75,26.31 U5.25 30.05,26.31 32.48,23.88 U9.1 ; 27.75,36.71 U5.9 ; v1(36.07,22.07) 37.29,23.28 37.29,27.05 38.67,28.42 v1(38.67,29.56) ; v1(36.62,20.21) 37.1,19.74 37.1,18 36.94,18 36.94,17.58 36.67,17.58 36.67,16.67 37.01,16.33 40.31,16.33 43.34,19.36 ; v1(51.92,34.03) 51.92,34.92 U8.81 50.25,36.59 v1(50.25,39.08) ; U7.3 U7.2 ; 39.48,45.85 C9.1 ; 39.48,45.85 39.55,45.93 39.55,47.25 ; 55.02,32.2 53.92,32.2 53.76,32.03 53.76,31.6 U8.62 53.76,31.57 53.76,31.14 53.83,31.07 C22.2 53.83,29.65 ; 55.02,32.2 55.06,32.16 v1(55.06,31.5) ; 40.57,26.66 39.98,26.07 v1(39.3,26.07) ; 53.35,47.16 53.34,47.17 ; v1(54.41,29.08) 54.41,29.21 C20.1 53.9,29.72 53.83,29.65 ; 36.94,51.24 36.89,51.24 36.86,51.27 ; 40.8,33.23 41.33,32.7 42.16,32.7 43.07,33.6 C25.1 42.49,34.11 41.78,34.81 41.78,35.4 41.94,35.4 42.72,36.17 C34.2 42.72,36.94 C12.2 ; 40.8,33.23 40.95,33.38 U6.2 ; 40.8,33.23 39.52,31.95 37.81,31.95 37.65,31.79 37.65,30.58 v1(38.67,29.56) ; R26.1 37.55,38.95 37.55,39.08 ; U62.3 38.82,48.66 v1(38.82,48.48) 39.55,47.75 39.55,47.25 ; C10.1 40.18,47.87 39.55,47.25 ; v1(53.3,48.02) 53.3,47.22 52.81,47.71 51.7,47.71 51.7,48.41 C19.1 ; C6.2 25.72,45.12 U5.1 27.75,41.91 27.39,41.55 27.39,40.25 27.68,39.96 ; C36.1 C35.1 ; R2.2 58.57,47.12 Q1.2 58.13,47.05 D1.2 58.13,45.58 57.06,44.52 54.84,44.52 v1(54.72,44.4) 53.63,44.4 C23.1 53.51,45.59 53.9,45.97 53.9,46.7 53.42,47.17 ; v1(38.67,29.56) 39.42,29.56 39.75,29.23 ; C28.1 41.45,38.47 41.32,38.34 40.58,39.08 37.55,39.08 ; 36.53,40.74 36.09,40.74 32.71,37.36 U5.8 ; C1.1 47.03,15.46 50.88,19.3 v1(50.88,20.2) 50.64,19.96 43.94,19.96 43.34,19.36 ; 59.39,36.82 58.46,36.82 58.39,36.75 ; 59.39,36.82 59.39,35.87 C24.1 60.22,35.78 v1(60.24,35.8) ; 59.39,36.82 59.09,37.13 59.01,37.13 58.84,37.29 58.84,37.37 58.4,37.82 58.39,37.82 ; 46.98,29.48 46.98,28.96 v1(46.82,28.8) ; C29.1 C30.1 49.54,45.97 U11.4 49.13,45.64 v1(48.06,45.64) ; C32.1 v1(57.06,41.74) ; 43.34,19.36 43.28,19.42 ; 34.94,19.86 C15.2 ; C27.1 51.1,28.75 51.1,28.38 51.08,28.36 v1(51.08,28.04) 51.08,27.22 50.35,26.49 50.35,23.94 50.51,23.78 50.51,23.43 C16.1 C17.1 50.31,21.88 v1(49.79,21.35) ; 53.83,29.65 C21.1 ; 37.55,40.74 37.48,40.74 36.92,41.3 36.15,41.3 33.05,38.2 29.13,38.2 28.94,38.01 ; R54.1 41.64,35.4
(no net): length 28.9
  Top Layer w0.254: v1(37,48.3) 37,46.53 41.63,41.9 41.63,38.2 43.18,36.65 55.67,36.65 v1(56.33,37.31)
  Bottom Layer w0.254: v1(37,48.3) 37.65,47.64 U62.5
BOOTSEL: length 54.8
  Top Layer w0.254: v1(60.97,19.22) 49.69,19.22 48.57,20.34 v1(48.57,21.46)
  Bottom Layer w0.254: v1(60.97,19.22) 60.97,15.36 62.17,14.16 64.75,14.16 65.78,13.12 88.42,13.12 SW1.3 ; v1(48.57,21.46) 48.32,21.71 R36.2
BUZZER: length 16.4
  Top Layer w0.254: v1(49.15,40.61) 53.65,45.1 v1(54.16,45.1)
  Bottom Layer w0.254: U8.26 48.56,41.39 48.56,40.95 48.9,40.61 v1(49.15,40.61) ; v1(54.16,45.1) 54.28,44.98 56.4,44.98 57.06,45.64 57.06,48.03 Q1.1 58.98,49.03 R2.1
CAPTOUCH_00: length 29.7
  Top Layer w0.254: 33.75,62.91 33.75,57.6 v1(34.54,56.81) ; v1(34.56,54.8) 34.74,54.98 36.65,54.98 42.08,49.55 42.47,49.55 v1(48.67,43.35)
  Bottom Layer w0.254: U8.28 49.35,42.4 R1.1 49.16,42.87 v1(48.67,43.35) ; v1(34.54,56.81) 34.56,56.79 v1(34.56,54.8)
CAPTOUCH_01: length 23.1
  Top Layer w0.254: TOUCH_MENU1.1 69.71,48.53 v1(62.64,48.53)
  Bottom Layer w0.254: v1(62.64,48.53) 62.62,48.51 61.34,48.51 59.42,46.59 59.42,45 58.32,43.91 55.06,43.91 54.65,43.5 53.89,43.5 52.54,42.15 52.54,41.41 U8.36
CAPTOUCH_02: length 42.3
  Top Layer w0.254: TOUCH_YES1.1 82.85,47.41 76.57,53.69 63.94,53.69 62.03,51.78 62.03,47.47 v1(61.27,46.7)
  Bottom Layer w0.254: U8.37 52.96,41.41 52.96,42.07 54.03,43.15 54.8,43.15 55.21,43.55 58.58,43.55 59.77,44.74 59.77,46.08 60.33,46.63 61.2,46.63 v1(61.27,46.7)
CAPTOUCH_03: length 56.3
  Top Layer w0.254: v1(60.36,44.82) 60.36,46.61 61.68,47.94 61.68,51.93 63.79,54.05 90.19,54.05 TOUCH_NO1.1
  Bottom Layer w0.254: R10.1 61.35,44.82 v1(60.36,44.82) 58.73,43.2 55.35,43.2 54.95,42.79 54.18,42.79 53.36,41.97 53.36,41.41 U8.38
CAPTOUCH_04: length 25.3
  Top Layer w0.254: TOUCH_CCW1.1 68.8,33.41 61.22,40.99 61.22,43.66 v1(61.5,43.94)
  Bottom Layer w0.254: U8.39 53.76,41.41 53.76,41.87 54.33,42.44 55.09,42.44 55.5,42.84 59.01,42.84 60.05,43.89 R11.1 61.73,43.89 61.68,43.94 v1(61.5,43.94)
CAPTOUCH_05: length 34
  Top Layer w0.254: v1(61.89,41.43) 62.82,41.43 64.12,40.14 77.1,40.14 TOUCH_UP1.1
  Bottom Layer w0.254: 54.15,41.4 54.83,42.08 55.24,42.08 55.65,42.49 59.99,42.49 60.02,42.46 61.12,42.46 R15.1 61.89,41.69 v1(61.89,41.43)
CAPTOUCH_06: length 50.8
  Top Layer w0.254: TOUCH_CW1.1 89.34,40.9 65.36,40.9 64.22,42.05 64.22,43.09 62.79,44.52 60.9,44.52 59.75,43.37 59.75,41.42 v1(59.49,41.17)
  Bottom Layer w0.254: R18.1 60.38,41.17 v1(59.49,41.17) 58.49,40.16 56.32,40.16 56.05,39.89 U8.42
CAPTOUCH_07: length 30.3
  Top Layer w0.254: TOUCH_LEFT1.1 63,27.25 63,37.46 v1(61.83,38.63)
  Bottom Layer w0.254: U8.43 56.15,39.49 56.37,39.71 61.12,39.71 R19.1 61.83,39.01 v1(61.83,38.63)
CAPTOUCH_08: length 44
  Top Layer w0.254: v1(60.87,38.68) 61.06,38.68 61.59,39.21 62.07,39.21 63.56,37.73 63.56,28.41 65.6,26.37 76.87,26.37 TOUCH_DOWN1.1
  Bottom Layer w0.254: U8.44 56.26,39.09 56.44,39.28 60.26,39.28 v1(60.87,38.68) 61.42,38.12 R20.1
CAPTOUCH_09: length 68.5
  Top Layer w0.254: TOUCH_RIGHT1.1 96.83,17.93 91.98,13.08 65.82,13.08 62.37,16.53 62.37,36.35 60.14,38.58 v1(60,38.58)
  Bottom Layer w0.254: R21.1 60.41,38.17 v1(60,38.58) 59.68,38.9 56.78,38.9 56.73,38.85 56.52,38.85 56.36,38.69 U8.45
CAPTOUCH_RET: length 20
  Bottom Layer w0.254: 62.12,45.76 62.12,47.39 61.87,47.64 R8.2 ; 62.12,45.76 R10.2 61.42,45.76 R9.2 ; 62.12,45.76 62.12,43.02 ; R11.2 61.42,43.02 R15.2 62.12,43.02 ; R21.2 R20.2 61.68,37.13 61.76,37.13 62.41,37.78 62.41,40.2 62.49,40.28 ; 62.12,43.02 62.12,42.03 62.48,41.67 62.48,40.29 62.49,40.28 ; U8.27 48.95,41.85 48.29,42.51 48.29,42.59 ; 62.49,40.28 R19.2 61.42,40.28 R18.2
CC1: length 1.6
  Bottom Layer w0.254: 41.39,18 41.39,19.04 41.77,19.42
DEBUG_G: length 1.9
  Bottom Layer w0.254: 57.14,37.82 57.07,37.89 U8.47
DEBUG_R: length 1.9
  Bottom Layer w0.254: U17.2 57.02,38.3 56.78,38.3 56.77,38.29 U8.46
DM: length 6
  Bottom Layer w0.2: 52.15,31.59 52.15,31.01 52.04,30.9 52.04,26.06 52.14,25.97 R33.2
DMX: length 18.2
  Bottom Layer w0.2: 39.89,18 39.89,18.77 41.51,20.39 50.24,20.39 51.42,21.56 51.42,23.45 R33.1
  Bottom Layer w0.254: 40.31,19.19 40.89,18.61 40.89,18
DP: length 5.9
  Bottom Layer w0.2: R32.2 51.69,26.6 51.69,31.05 51.75,31.11 U8.67
DPX: length 18.8
  Bottom Layer w0.2: 39.39,18 39.39,18.77 41.36,20.75 50.1,20.75 51.06,21.71 R32.1
  Bottom Layer w0.254: 39.39,18 39.39,17.38 39.62,17.15 40.16,17.15 40.39,17.38 40.39,18
HALL: length 36.2
  Top Layer w0.254: v1(57.52,35.71) 56.47,35.71 55.88,36.29 43.03,36.29 41.27,38.05 41.27,41.67 38.28,44.66 v1(29.5,44.66)
  Bottom Layer w0.254: U8.52 57.33,35.89 v1(57.52,35.71)
IR_RXD: length 28.3
  Top Layer w0.254: v1(57.34,27.8) 54.65,25.11 v1(54.1,25.11)
  Bottom Layer w0.254: v1(54.1,25.11) 53.14,24.16 53.14,23.94 52.98,23.78 52.77,23.78 52.14,23.16 52.14,19.56 48.47,15.89 48.47,14.31 48.4,14.24 R16.1 ; U8.54 55.27,35.08 56.78,35.08 58.57,33.3 58.57,29.38 57.34,28.15 v1(57.34,27.8)
IR_TXD: length 13.1
  Top Layer w0.254: v1(43.59,49.55) 43.59,49.26 49.26,43.59 49.26,43.11 48.34,42.2 v1(48.34,40.34)
  Bottom Layer w0.254: v1(48.34,40.34) 48.33,40.34 48.15,40.52 48.15,41.4
MAT00: length 78.1
  Top Layer w0.16: U32.2 U32.4 56.68,14.28 55.34,14.28 55.21,14.14 55.21,13.51 55.01,13.31 54.43,13.31 53.29,12.18 51.52,12.18 51.16,12.54 49.97,12.54 49.1,13.41 49.1,14.14 48.96,14.28 47.77,14.28 47.29,13.79 U28.2 U28.4 U26.2 U26.4 ; U20.1 U20.3
  Top Layer w0.254: U16.3 U16.1 ; U16.3 U14.1 U14.3 ; U16.3 28.26,15.61 v1(27.95,15.92) ; v1(54.84,12.4) 55.69,12.4 57.08,13.79 U32.4 ; U20.1 35.03,15.04 35.52,15.53 35.52,16.75 34.78,17.49 v1(29.42,17.49) 30.33,18.4 30.33,19.2 30.67,19.54 31.47,19.54 36.48,24.55 41.26,24.55 41.46,24.76 v1(41.84,24.76) ; v1(46.23,30.74) 45.21,29.71 44.88,29.71 44.33,29.16 44.33,28.38 45.87,26.84 v1(45.87,26.09) 45.87,25.66 45.42,25.21 45.42,24.3 45.77,23.96 45.77,21.77 46.84,20.69 46.84,19.33 48.93,17.24 50.3,17.24 v1(50.71,16.83)
  Bottom Layer w0.254: v1(46.23,30.74) 46.55,31.05 U8.80 ; v1(27.95,15.92) 29.42,17.39 v1(29.42,17.49) ; v1(54.84,12.4) 54.66,12.57 ; v1(45.87,26.09) 44.81,25.04 42.12,25.04 v1(41.84,24.76) ; 53.29,13.08 53.13,13.25 53.13,14.06 50.71,16.48 v1(50.71,16.83)
MAT01: length 71.6
  Top Layer w0.16: U29.2 U29.4 47.92,13.79 47.44,13.31 44.7,13.31 44.54,13.47 44.54,13.5 44.24,13.79 U27.2 ; U33.4 U33.2 ; U21.1 36.38,15.04 ; U27.2 44.6,14.3 45.65,14.3 46.06,14.71 46.06,15.76 46.08,15.78 ; U27.2 U27.4
  Top Layer w0.254: v1(44.66,30.96) 44.6,30.9 44.6,30.44 43.62,29.46 43.62,28.09 44.6,27.1 v1(44.6,25.75) 44.6,23.3 44.91,22.99 44.91,19.74 46.08,18.57 46.08,15.78 ; U21.3 36.38,15.04 36.48,15.15 36.48,17.09 ; 36.48,17.09 41.2,21.81 41.2,23.74 41.64,24.17 42.24,24.17 42.49,24.43 42.49,25.6 v1(42.47,25.62) ; 36.48,17.09 34.61,18.96 v1(30.91,18.96) ; U13.1 U13.3 28.32,16.5 27.34,16.5 25.89,15.04 U15.1 U15.3 ; U33.4 55.64,13.44 55.21,13 54.62,13 53.48,11.87 51.39,11.87 51.03,12.23 49.85,12.23 48.67,13.41 U29.2
  Bottom Layer w0.254: v1(30.91,18.96) 30.06,18.96 27.58,16.48 v1(27.29,16.48) ; v1(44.6,25.75) 42.6,25.75 v1(42.47,25.62) ; U8.2 45.43,33.08 44.99,33.08 44.66,32.75 v1(44.66,30.96)
MAT02: length 51.8
  Top Layer w0.16: U22.1 U22.3 ; U12.1 U12.3 ; U30.4 U30.2 ; U34.4 U34.2
  Top Layer w0.254: v1(47.3,17.49) 48.72,16.07 v1(49.84,16.07) ; v1(41.92,22.3) 41.92,19.67 v1(38,15.75) U22.1 ; v1(34.94,15.95) 33.46,15.95 33.43,15.91 U12.1 ; U34.4 54.11,13.44 53.17,12.49 51.65,12.49 51.06,13.07 v1(50.2,13.07) 50.19,13.08 U30.2 ; v1(44,31.92) 44,30.45 43.26,29.71 43.26,26.27 44.25,25.28 44.25,23.16 44.32,23.08 v1(44.32,22.52) 44.32,19.51 v1(44.46,19.37)
  Bottom Layer w0.254: v1(44.32,22.52) 42.14,22.52 v1(41.92,22.3) ; U8.3 45.43,33.48 44.89,33.48 44,32.59 v1(44,31.92) ; v1(44.46,19.37) 46.87,19.37 R40.1 46.98,19.4 47.44,18.93 47.44,17.64 v1(47.3,17.49) ; v1(34.94,15.95) 36.83,15.95 36.86,15.98 37.77,15.98 v1(38,15.75) ; v1(49.84,16.07) 49.84,13.43 v1(50.2,13.07)
MAT02R: length 28.9
  Top Layer w0.16: U14.2 27.16,13.96 27.16,14.14 27.03,14.28 26.44,14.28 25.95,13.79 U15.2 ; U26.1 45.45,14.88 45.45,14.7 45.32,14.56 44.72,14.56 44.43,14.85 44.29,14.85 U27.1
  Top Layer w0.254: v1(45.5,15.86) 45.57,15.78 45.57,15.09 U26.1 ; v1(42.51,12.78) 42.24,12.5 40.1,12.5 39.6,13 33.9,13 33.61,12.71 28.41,12.71 U14.2
  Bottom Layer w0.254: v1(42.51,12.78) 42.51,13.4 44.97,15.86 v1(45.5,15.86) 46.72,17.08 46.72,17.74 46.9,17.91 R40.2
MAT03: length 71.8
  Top Layer w0.16: U23.3 U23.1 U27.3 43.66,15.21 43.66,15.39 43.8,15.53 44.1,15.53 ; U19.1 U19.3 30.8,14.54 25.65,14.54 25.21,14.09 U15.4 25.21,13.62 25.51,13.31 26.25,13.31 U14.4 ; U31.4 U31.2 U35.4 U35.2 ; U26.3 44.87,15.04 44.1,15.82
  Top Layer w0.254: v1(49.89,11.29) 49.59,11.29 48.79,10.49 47.86,10.49 47.2,11.15 47.2,12.08 46.72,12.57 44.41,12.57 44.2,12.78 v1(43.49,12.78) 43.33,12.78 42.71,12.15 39.95,12.15 39.45,12.65 34.05,12.65 33.71,12.31 27.97,12.31 26.85,13.43 26.85,13.67 U14.4 ; v1(44.1,15.82) 43.74,16.18 43.74,22.84 ; U35.4 51.92,13.08 v1(51.88,13.08) ; 43.74,22.84 43.75,22.84 ; 43.74,22.84 43.74,25.21 42.91,26.04 42.91,29.86 43.19,30.14 v1(43.19,31.62)
  Bottom Layer w0.254: v1(51.88,13.08) 51.4,12.6 51.2,12.6 v1(49.89,11.29) ; v1(43.49,12.78) 43.33,12.78 42.75,12.19 41.93,12.19 41.88,12.25 41.88,13.71 43.98,15.82 v1(44.1,15.82) ; U8.4 45.43,33.88 44.79,33.88 43.19,32.28 v1(43.19,31.62)
MAT04: length 73.3
  Top Layer w0.16: U13.4 29.78,14.26 29.76,14.28 ; U30.3 49.59,14.61 49.54,14.56 ; 48.06,14.56 46.85,14.56 46.71,14.7 46.71,14.88 U28.3 ; 48.06,14.56 49.54,14.56 ; 48.06,14.56 48.07,14.57 U29.3 ; 29.76,14.28 31.31,14.28 ; 29.76,14.28 28.56,14.28 28.38,14.1 28.38,13.84 28.33,13.79 U16.4 28.31,13.74 28.31,13.62 28.42,13.5 28.42,13.45 28.56,13.31 28.61,13.31 28.9,13.02 33.49,13.02 33.92,13.46 33.92,14.14 34.32,14.54 38.47,14.54 38.92,14.99 U24.3 ; 49.54,14.56 51.1,14.56 ; 51.1,14.56 52.01,14.56 52.15,14.7 52.15,16.19 52.89,16.93 v1(57.92,16.93) ; 51.1,14.56 51.12,14.58 U31.3 ; 31.31,14.28 31.3,14.27 U19.4 ; 31.31,14.28 32.35,14.28 U12.4 ; U36.4 U36.2 ; U24.3 U24.1 ; U24.3 38.97,15.09 38.97,15.75
  Top Layer w0.254: 38.97,15.75 42.63,19.41 42.63,22.41 41.87,23.17 v1(41.87,23.45) ; U36.2 58.73,13.19 v1(58.27,13.19) ; U28.3 46.54,18.62 45.27,19.89 45.27,23.63 v1(45.19,23.72) 45.19,24.04 45.07,24.16 45.07,25.36 45.19,25.48 45.19,27.02 43.97,28.23 43.97,29.31 45.5,30.83 45.5,31.29 v1(45.44,31.34)
  Bottom Layer w0.254: v1(58.27,13.19) 58.37,13.09 58.37,13.08 58.21,13.25 58.21,14.67 57.92,14.95 v1(57.92,16.93) ; U8.1 45.44,32.69 v1(45.44,31.34) ; v1(45.19,23.72) 45.18,23.71 42.13,23.71 v1(41.87,23.45)
MAT05: length 57.8
  Top Layer w0.16: U37.4 U37.2 ; 44.56,12.92 44.56,13.02 44.27,13.31 43.2,13.31 43,13.51 43,14.14 42.87,14.28 41.96,14.28 41.19,15.04 U25.1 U25.3
  Top Layer w0.254: 44.56,12.92 48.65,12.92 49.7,11.87 50.89,11.87 51.24,11.52 54.21,11.52 54.53,11.83 54.58,11.83 54.59,11.81 55.6,11.81 56.4,12.61 59.03,12.61 60.18,13.76 U37.2 60.86,14.43 60.95,14.52 61.18,14.52 61.34,14.68 61.34,16.26 58.93,18.66 49.36,18.66 v1(49.03,18.99) 47.96,20.06 47.96,27.86 47.68,28.14 46.65,28.14 46.23,28.55 46.23,29.04 47.58,30.38 v1(47.58,32.37)
  Bottom Layer w0.254: v1(49.03,18.99) 48.62,19.4 R43.1 ; v1(47.58,32.37) 47.35,32.15 U8.78
MAT05R: length 35.6
  Top Layer w0.16: 48.78,15.53 48.78,15.15 U29.1 ; 48.78,15.53 50.22,15.53 ; 48.78,15.53 47.77,15.53 47.29,15.04 U28.1 ; U31.1 51.72,15.22 51.41,15.53 50.22,15.53 ; 50.22,15.53 50.22,15.07 U30.1 ; U16.2 29,13.79 29.48,13.31 30.33,13.31 ; 30.33,13.31 30.38,13.36 U13.2 ; 30.33,13.31 31.84,13.31 ; U19.2 31.9,13.37 31.84,13.31 ; 31.84,13.31 33.12,13.31 33.26,13.45 33.26,13.63 U12.2 33.43,14.27 33.92,14.76 33.92,15.39 34.09,15.56 v1(34.09,15.75)
  Top Layer w0.254: v1(47.22,16.47) 47.77,15.92 47.77,15.57
  Bottom Layer w0.254: v1(34.09,15.75) 34.31,15.75 35.41,14.65 38.51,14.65 41.33,11.84 43.37,11.84 44.21,12.67 44.21,14.39 44.47,14.65 45.4,14.65 v1(47.22,16.47) 48.06,17.31 R43.2
MAT06: length 63.4
  Top Layer w0.16: 54.15,15.53 52.94,15.53 52.81,15.39 52.81,15.21 U35.3 ; 54.15,15.53 54.15,15.08 U34.3 ; 54.15,15.53 55.69,15.53 ; U24.4 38.95,13.83 38.95,14.28 ; 38.95,14.28 40,14.28 ; 38.95,14.28 37.45,14.28 ; 40,14.28 40.43,14.28 ; 40,14.28 40,15.82 ; 35.91,14.28 34.66,14.28 34.52,14.14 34.52,13.84 34.47,13.79 U20.4 ; 35.91,14.28 37.45,14.28 ; 35.91,14.28 35.91,13.83 U21.4 ; 40.43,14.28 40.45,14.26 U25.4 ; 40.43,14.28 41.49,14.28 U23.4 ; U33.3 55.69,15.09 55.69,15.53 ; 37.45,14.28 37.45,13.85 U22.4 ; 55.69,15.53 57.2,15.53 ; 57.2,15.53 59.63,15.53 60.11,15.04 U37.3 ; 57.2,15.53 57.2,15.08 U32.3
  Top Layer w0.254: v1(46.99,30.65) 45.7,29.36 45.03,29.36 44.69,29.01 44.69,28.53 46.54,26.67 46.54,25.82 45.78,25.06 45.78,24.52 45.83,24.47 45.83,24.45 46.35,23.93 v1(46.35,23.48) 46.35,23.22 47.2,22.38 47.2,19.47 49.08,17.59 58.08,17.59 58.5,17.18 58.5,15.28 U36.3 ; 40,15.82 43.03,18.84 43.03,23.02 42.94,23.11 v1(42.78,23.11)
  Bottom Layer w0.254: U8.79 46.95,30.69 v1(46.99,30.65) ; v1(42.78,23.11) 42.8,23.13 46.01,23.13 v1(46.35,23.48)
MAT07: length 3.3
  Bottom Layer w0.254: 47.75,31.59 47.76,31.58 47.76,30.33 47.46,30.03 46.35,30.03 R44.1
MAT07R: length 63.3
  Top Layer w0.16: 39.48,13.31 39.52,13.36 U24.2 ; 39.48,13.31 38.06,13.31 ; 39.48,13.31 41.09,13.31 ; U35.1 53.72,14.56 54.7,14.56 ; 59.32,14.56 60.56,14.56 60.69,14.7 60.69,15 60.74,15.04 U37.1 ; 59.32,14.56 59.34,14.58 U36.1 ; 59.32,14.56 57.7,14.56 ; 41.09,13.31 41.09,13.75 U25.2 ; 41.09,13.31 42.57,13.31 U23.2 ; 38.06,13.31 36.45,13.31 ; 38.06,13.31 38.06,13.74 U22.2 ; 57.7,14.56 56.5,14.56 ; 57.7,14.56 57.76,14.62 U32.1 ; 56.5,14.56 56.49,14.58 56.36,14.58 56.29,14.65 56.29,14.99 U33.1 ; 56.5,14.56 54.7,14.56 ; 36.45,13.31 35.58,13.31 35.1,13.79 U20.2 ; 36.45,13.31 36.48,13.34 U21.2 ; 54.7,14.56 54.71,14.58 U34.1 ; v1(41.29,13.09) 41.52,13.31
  Top Layer w0.254: v1(45.27,28.77) 46.9,27.14 46.9,25.68 46.36,25.14 v1(46.36,24.76) 47.56,23.57 47.56,19.64 49.14,18.05 58.13,18.05 60.74,15.44 60.74,15.17 U37.1 ; v1(43.08,24.3) 43.38,23.99 43.38,16.05 v1(43.04,15.7)
  Bottom Layer w0.254: R44.2 45.96,28.77 v1(45.27,28.77) ; v1(43.04,15.7) 41.29,13.96 v1(41.29,13.09) ; v1(43.08,24.3) 45.9,24.3 v1(46.36,24.76)
MAT10: length 131.1
  Top Layer w0.16: U61.3 22.58,55.61 23.06,55.13 24.11,55.13 24.58,55.6 47.03,55.6 47.03,57.63
  Top Layer w0.254: U61.3 U61.1 22.49,60.15 21.65,60.99 21.65,62.58 23,63.93 U50.3 U50.1 ; 65.74,57.67 66.95,57.67 v1(67.23,57.4) ; 65.74,57.67 67.61,59.54 70.25,59.54 70.7,59.99 71.93,59.99 72.27,60.32 72.27,63.07 73.5,64.3 74.69,64.3 74.79,64.39 75.52,64.39 76,63.91 U49.2 U49.4 76.4,63.1 75.01,61.71 74.7,61.71 v1(74.02,61.03) ; 65.74,57.67 U58.2 U58.4 ; v1(50.25,55.04) 49.62,55.04 46.14,58.52 46.14,61.51 46.43,61.8 v1(47.69,61.8) 47.91,62.03 47.91,68.35 47.38,68.88 47.38,69.15 U52.3 U52.1 ; v1(80.69,57.32) 80.43,57.06 U44.2 U44.4
  Bottom Layer w0.254: v1(74.02,61.03) 74.02,60.61 77.32,57.32 v1(80.69,57.32) ; U8.17 45.43,39.1 44.84,39.1 44.35,39.59 44.35,40.71 44.73,41.09 44.73,48.23 50.25,53.75 v1(50.25,55.04) ; v1(47.69,61.8) 48.21,62.33 50.57,62.33 54.2,58.69 65.49,58.69 66.79,57.4 v1(67.23,57.4)
MAT11: length 145.3
  Top Layer w0.16: U53.3 20.93,60.94 21.96,59.91 21.96,55.29 22.48,54.77 24.25,54.77 24.82,55.34 48.82,55.34 50.25,53.91 50.61,53.91 51.62,54.93 v1(51.62,55.39) ; U51.4 70.38,56 65.96,56 65.18,56.78 65.18,57.97 67.07,59.85 69.66,59.85 U43.4
  Top Layer w0.254: U60.4 U60.2 83.51,60.11 83.29,60.33 83.29,60.42 82.87,60.84 79.67,60.84 76.71,57.89 71.67,57.89 U51.2 U51.4 ; v1(71.61,62.32) 71.53,62.32 U43.2 U43.4 ; v1(46.72,61.07) 47.03,60.77 U41.1 U41.3 47.15,59.87 v1(51.62,55.39) ; U56.1 U56.3 26.42,71.68 22.47,67.73 22.47,63.9 20.93,62.36 U53.1 U53.3
  Bottom Layer w0.254: v1(51.62,55.39) 51.83,55.19 51.83,54.32 45.44,47.93 U8.20 ; v1(46.72,61.07) 46.65,61.14 46.65,63.17 46.29,63.52 46.29,66.84 46.88,67.42 51.06,67.42 53.72,64.76 53.72,64.74 60.96,64.74 64,61.7 65.49,61.7 66.91,60.28 70.59,60.28 71.72,61.4 71.72,62.22 71.61,62.32 v1(71.61,62.32)
MAT12: length 105.2
  Top Layer w0.254: 75.62,59.75 75.62,59.15 75.22,58.74 72.92,58.74 v1(72.81,58.64) ; U55.3 32.38,74.8 ; 32.38,74.8 32.71,74.8 33.25,75.34 33.61,75.34 34.4,76.14 41.59,76.14 42.52,75.2 45.22,75.2 49.67,70.74 U57.1 U57.3 50.04,65.23 50.04,64.84 50.56,64.32 v1(50.56,63.87) 50.6,63.87 51.02,63.45 49.37,61.8 v1(49.37,61.13) ; 32.38,74.8 U55.1 ; 75.62,59.08 76.7,59.08 v1(77.38,59.76) ; 88.74,56.36 88.74,57.61 v1(88.12,58.24)
  Bottom Layer w0.254: v1(72.81,58.64) 66.55,58.64 60.81,64.38 51.07,64.38 v1(50.56,63.87) ; v1(49.37,61.13) 50.76,61.13 52.56,59.32 R48.1 52.56,54.05 46.16,47.64 46.16,40.95 46.92,40.19 46.92,39.36 46.26,38.7 45.45,38.7 U8.16 ; v1(77.38,59.76) 78.23,58.91 78.23,57.83 78.31,57.91 78.79,57.91 79.12,58.24 v1(88.12,58.24)
MAT12R: length 79.7
  Top Layer w0.16: v1(46.88,66.3) 46.62,66.05 46.62,63 45.43,61.8 45.43,57.04 44.52,56.13 23.82,56.13 U61.2
  Top Layer w0.254: U43.1 69.54,61.58 69.3,61.58 68.24,60.52 64.08,60.52 63.54,59.98 63.54,58.55 U58.1 64.17,57.67 64.06,57.78 v1(59.61,57.78) ; U53.2 22.54,61.9 23.52,60.92 23.52,56.43 U61.2
  Bottom Layer w0.254: v1(59.61,57.78) 59.05,58.34 54.05,58.34 50.68,61.71 49,61.71 47.95,60.67 ; 47.95,60.67 48.18,60.44 50.95,60.44 51.7,59.68 R48.2 ; 47.95,60.67 47.1,61.52 47.1,62.04 47.24,62.18 47.24,63.88 46.75,64.37 46.75,64.85 47.24,65.34 47.24,65.94 v1(46.88,66.3)
MAT13: length 132.4
  Top Layer w0.16: U58.3 64.66,57.07 64.9,57.31 64.9,58.16 66.2,59.46 66.2,59.72 ; 66.2,59.72 66.2,60.11 68.67,60.11 U43.3 ; 66.2,59.72 64.14,59.72 v1(64.12,59.74) ; v1(47.33,64.61) 47.33,63.2 45.78,61.65 45.78,56.89 44.76,55.87 24.24,55.87 23.98,55.61 U61.4
  Top Layer w0.254: v1(81.31,63.06) 81.68,63.06 U46.4 ; U46.4 83.09,63.98 83.53,63.54 88.05,63.54 U45.2 U45.4 ; U46.4 U46.2 ; U39.1 U39.3 41.05,74.36 41.53,73.88 44.37,73.88 46.42,71.84 46.42,69.27 47.56,68.14 47.56,64.84 v1(47.33,64.61) ; U54.1 U54.3 53.33,60.99 v1(53.34,60.98) 53.43,60.89 v1(53.43,57.72) ; U61.4 23.69,55.55 23.55,55.55 23.17,55.94 23.17,59.98 22.18,60.96 U53.4
  Bottom Layer w0.254: v1(64.12,59.74) 64.01,59.63 53.77,59.63 53.34,60.06 v1(53.34,60.98) 51.63,62.68 48.49,62.68 48.09,63.07 48.09,63.84 v1(47.33,64.61) ; v1(66.22,59.9) 66.45,59.67 71.21,59.67 73.15,61.61 79.87,61.61 v1(81.31,63.06) ; U8.21 46.55,47.53 54.02,55 54.02,57.12 53.43,57.71 v1(53.43,57.72)
MAT14: length 128
  Top Layer w0.254: v1(48.68,63.32) 48.68,63.64 48.39,63.92 48.39,68.52 47.74,69.17 47.74,71.02 44.4,74.36 41.75,74.36 41.65,74.47 ; 69.89,56.51 70.36,56.99 70.36,58.65 70.94,59.22 71.22,59.22 71.27,59.28 72.99,59.28 ; 41.65,74.47 41.47,74.47 41.28,74.66 41.28,75.38 34.75,75.38 U55.4 33.63,73.9 31.54,71.81 U56.4 27.67,71.45 24.78,68.57 24.78,67.07 24.52,66.82 U50.4 ; 41.65,74.47 41.63,74.49 ; 72.99,59.28 74.35,59.28 U42.3 74.84,59.25 74.9,59.32 74.9,60.18 75.11,60.38 77.81,60.38 81.35,63.92 U46.3 81.59,63.98 81.88,64.26 81.88,64.7 82.23,65.06 82.96,65.06 83.13,64.9 83.13,64.45 83.68,63.9 88.46,63.9 88.7,63.8 91.2,61.3 ; 72.99,59.28 72.99,62.17 74.13,63.31 U49.3 ; 91.15,61.1 92.03,61.1 U48.2 U48.4 ; v1(54.01,60.21) 54.55,59.67 U38.1 U38.3 54.67,57.83 54.67,56.72 v1(56.56,54.83) ; v1(67.81,57.98) 67.81,57.74 68.91,56.63 69.52,56.63 U51.3
  Bottom Layer w0.254: 54.01,63.16 53.97,63.2 48.79,63.2 v1(48.68,63.32) ; 54.01,63.16 v1(54.01,60.21) ; 54.01,63.16 56.7,60.47 64.22,60.47 66.41,58.28 67.5,58.28 v1(67.81,57.98) ; v1(56.56,54.83) 54.35,54.83 46.95,47.43 U8.22
MAT15: length 70.3
  Top Layer w0.254: v1(58.83,56.26) 59.33,55.77 U40.1 U40.3 59.81,54.67 61.16,54.67 61.41,54.93 95.69,54.93 95.97,54.66 97.36,54.66 U47.4 U47.2
  Bottom Layer w0.254: U8.23 47.35,47.25 49.74,49.64 54.2,49.64 58.83,54.27 v1(58.83,56.26) 59.1,56 64.6,56 R47.1
MAT15R: length 93.9
  Top Layer w0.254: U50.2 24.25,68.8 27.14,71.69 27.14,72.16 27.39,72.41 U56.2 31.44,72.41 33.02,74 33.02,74.4 33.49,74.86 U55.2 34.55,75.78 41.44,75.78 41.89,75.32 U39.2 42.02,74.84 44.42,74.84 45.5,73.77 v1(45.82,73.77) ; 75.03,63.79 73.49,63.79 72.64,62.94 72.64,62.32 72.64,62.32 72.64,60.03 72.24,59.63 70.84,59.63 69.68,58.46 69.68,57.14 U51.1 69.26,57.11 v1(68.64,57.73) ; 74.37,59.89 74.37,60.34 75.08,61.05 77.46,61.05 80.99,64.58 U46.1 ; U42.1 74.13,59.85 73.35,60.64 73.35,61.54 v1(74.46,62.65) 75.12,62.65 75.31,62.83 75.52,62.83 75.68,63 75.68,63.63 75.52,63.79 75.27,63.79 U49.1
  Bottom Layer w0.254: v1(74.46,62.65) 74.17,62.93 71.36,62.93 69.22,60.79 67.27,60.79 66.01,62.06 64.22,62.06 61.18,65.09 54.5,65.09 v1(45.82,73.77) ; R47.2 65.53,57.71 66.42,56.81 67.73,56.81 v1(68.64,57.73)
MAT16: length 111.5
  Top Layer w0.254: 49.64,58.51 51.74,56.41 v1(51.75,56.41) ; 49.64,58.51 49.11,59.03 49.03,59.03 48.69,59.38 48.69,59.46 U41.4 48.25,59.85 48.01,59.85 47.55,60.3 47.55,60.79 48.27,61.5 48.27,62.09 48.28,62.09 49.38,63.19 49.38,63.44 48.79,64.03 48.79,69 U52.4 ; 49.64,58.51 50.41,58.51 51.26,59.36 51.26,62.43 52.65,63.82 ; U57.4 50.92,65.55 52.65,63.82 ; 52.65,63.82 53.86,62.61 53.86,62.17 54.34,61.7 54.37,61.7 54.47,61.59 U54.4 55.19,61.09 55.19,58.31 55.56,57.94 55.8,57.94 U38.4 56.68,57.07 58.85,57.07 59.86,56.06 59.86,55.63 60.33,55.15 U40.4 60.94,55.15 61.07,55.28 73.76,55.28 74.93,56.46 U44.3 78.69,56.41 79.17,55.93 80.37,55.93 81.58,57.14 81.58,58.36 ; 81.58,58.36 81.59,58.36 83.59,56.36 U59.3 87.5,56.36 87.73,56.36 88.02,56.65 88.02,57.38 86.31,59.09 86.31,59.74 ; 81.58,58.36 81.58,58.57 82.4,59.39 82.65,59.39 U60.3 ; U45.3 87.18,60.61 86.31,59.74 ; U47.3 96.04,55.14 92.43,58.75 92.43,58.84 U48.3 91.94,59.33 86.72,59.33 86.31,59.74
  Bottom Layer w0.254: v1(51.75,56.41) 51.75,56.12 52.21,55.66 52.21,54.2 45.8,47.79 45.8,40.77 46.05,40.52 46.05,40.07 45.88,39.89 U8.19
MAT17: length 19.5
  Bottom Layer w0.254: U8.18 45,39.49 44.81,39.69 44.81,40.54 45.09,40.81 45.09,48.08 50.83,53.83 R46.1
MAT17R: length 93.5
  Top Layer w0.254: U59.1 87.49,57.11 86.3,58.3 84.82,58.3 ; U41.2 48.32,60.52 48.7,60.52 ; 48.7,60.52 48.7,61.85 50.09,63.24 50.09,63.5 49.14,64.45 49.14,69.49 48.63,70 48.39,70 U52.2 ; 48.7,60.52 48.7,60.37 49.28,59.8 49.33,59.85 ; 84.82,58.3 84.82,58.24 83.11,58.24 83.49,58.62 83.49,59.63 83.13,59.98 82.89,59.98 U60.1 82.2,60.11 80.03,57.94 79.57,57.94 U44.1 74.82,57.06 73.4,55.64 62.2,55.64 62.09,55.75 U40.2 60.58,55.85 57.88,58.54 U38.2 55.8,61.32 54.8,62.32 54.6,62.32 U54.2 54.58,62.88 51.27,66.19 U57.2 50.39,66.19 50.39,64.99 51.47,63.91 51.47,63.39 50,61.92 50,60.52 49.33,59.85 ; 84.82,58.3 84.82,61.05 86.94,63.16 U45.1 87.43,63.16 87.9,62.69 87.9,61.99 90.09,59.81 U48.1 92.54,59.81 92.78,59.57 92.78,59.05 96.06,55.77 96.46,55.77 96.49,55.74 U47.1 ; 49.33,59.85 v1(50.59,59.85)
  Bottom Layer w0.254: v1(50.59,59.85) 50.78,59.85 51.06,59.57 51.06,57.83 49.99,56.76 49.99,55.97 R46.2
MIC_CLK: length 8.3
  Top Layer w0.254: v1(47.1,37.36) 47.01,37.36 46.5,37.86 45.07,37.86 44.79,38.14 44.79,41.91
  Bottom Layer w0.254: U8.14 45.45,37.88 45.89,37.88 45.92,37.85 46.19,37.85 46.21,37.84 46.53,37.84 47.01,37.36 v1(47.1,37.36)
MIC_DATA: length 6.6
  Top Layer w0.254: v1(46.29,37.25) 45.07,37.25 44.43,37.89 44.43,41.44
  Bottom Layer w0.254: U8.13 46.05,37.49 v1(46.29,37.25)
MOTOR: length 11.2
  Top Layer w0.254: v1(60.53,29.56) 59.42,29.56 53.68,35.3 v1(53.68,35.61)
  Bottom Layer w0.254: 54.09,37.08 53.68,36.67 v1(53.68,35.61)
OLED_CS: length 19
  Top Layer w0.254: v1(42.93,35.56) 42.68,35.56 40.02,38.23 v1(35.14,38.23)
  Bottom Layer w0.254: v1(42.93,35.56) 43,35.56 43.47,35.09 U8.7 ; v1(35.14,38.23) 32.32,35.41 U5.11
OLED_DC: length 17.6
  Top Layer w0.254: v1(42.59,34.83) 42.29,34.53 v1(40.19,34.53)
  Bottom Layer w0.254: v1(42.59,34.83) 42.73,34.69 U8.6 ; v1(40.19,34.53) 39.87,34.85 38.44,34.85 38.28,35.01 38.28,35.02 37.83,35.46 33.83,35.46 32.47,34.11 U5.13
OLED_MOSI: length 20.9
  Top Layer w0.254: v1(38.16,33.9) 38.47,33.59 44.12,33.59 v1(46.23,35.71)
  Bottom Layer w0.254: v1(38.16,33.9) 38.16,34 37.48,34.68 34.05,34.68 30.88,31.51 28.94,31.51 ; v1(46.23,35.71) 46.05,35.89 U8.9
OLED_SCK: length 19.2
  Top Layer w0.254: v1(43.9,35.68) 43.17,34.96 43.17,34.59 42.53,33.95 39.95,33.95 39.63,34.26 v1(39.09,34.26)
  Bottom Layer w0.254: v1(39.09,34.26) 38.86,34.49 38.3,34.49 37.72,35.07 33.94,35.07 31.03,32.16 U5.16 ; U8.8 44.09,35.49 v1(43.9,35.68)
QSPI_SCLK: length 7.5
  Bottom Layer w0.254: U10.6 48.01,25.39 49.03,26.42 49.03,27.32 50.15,28.44 50.15,31.59
QSPI_SD0: length 5.9
  Bottom Layer w0.254: 49.75,31.59 49.75,28.54 47.87,26.66 U10.5
QSPI_SD1: length 18.1
  Bottom Layer w0.254: 40.57,24.12 40.56,24.11 39.87,24.11 38.36,25.62 38.36,26.61 39.41,27.65 47.86,27.65 48.95,28.75 U8.74
QSPI_SD2: length 17.1
  Bottom Layer w0.254: 40.57,25.39 40.57,25.4 39.15,25.4 38.72,25.83 38.72,26.46 39.56,27.3 48,27.3 49.35,28.64 U8.73
QSPI_SD3: length 8.9
  Bottom Layer w0.254: U10.7 48.01,24.12 49.39,25.5 49.39,27.17 50.55,28.33 U8.70
